# EasyEDA Pro project Battery_Charger_V0.05.epro

# Schematic Schematic2

## Sheets
1 P1: Board Name: Battery_Charger_V0.02; Create Date: 2025-06-03; Page Name: P1; Project Name: OptoGrid_V0.02; Schematic Name: Schematic2; Update Date: 2025-06-11; Company: 嘉立创EDA; Page Size: A4; Version: V1.0
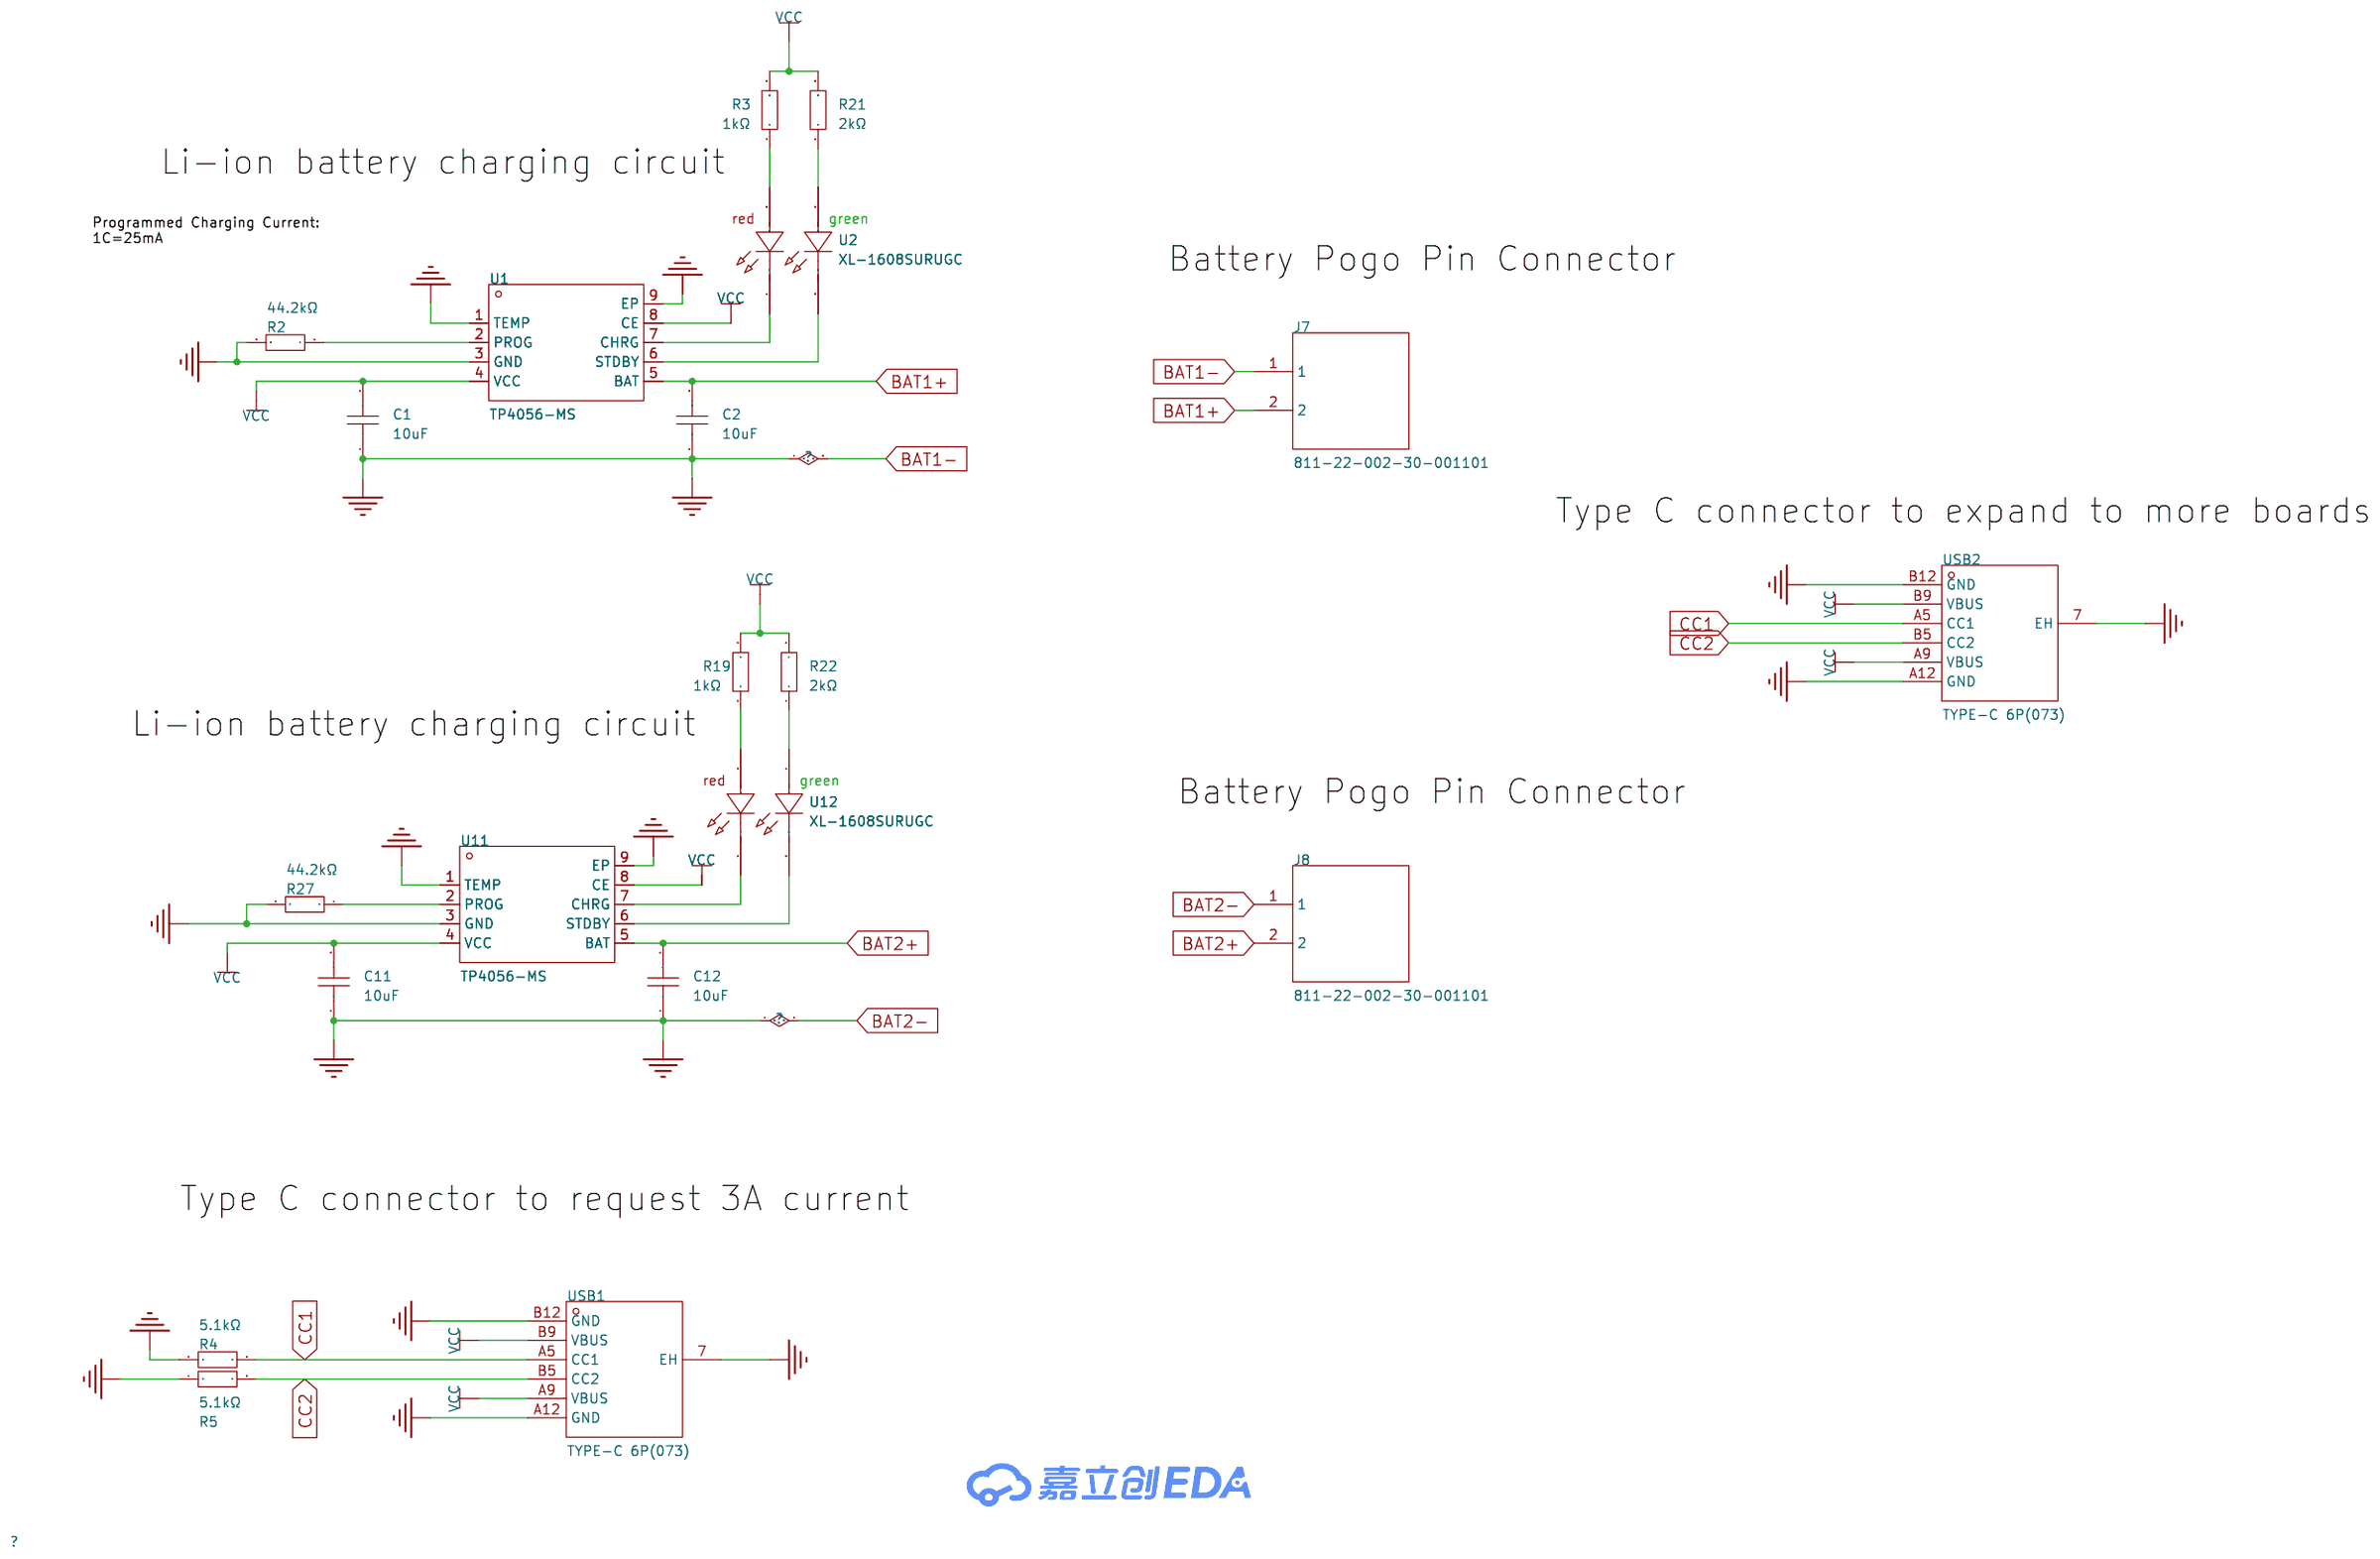
[diagram p0: P1]
2 P2: Create Date: 2025-06-04; Page Name: P2
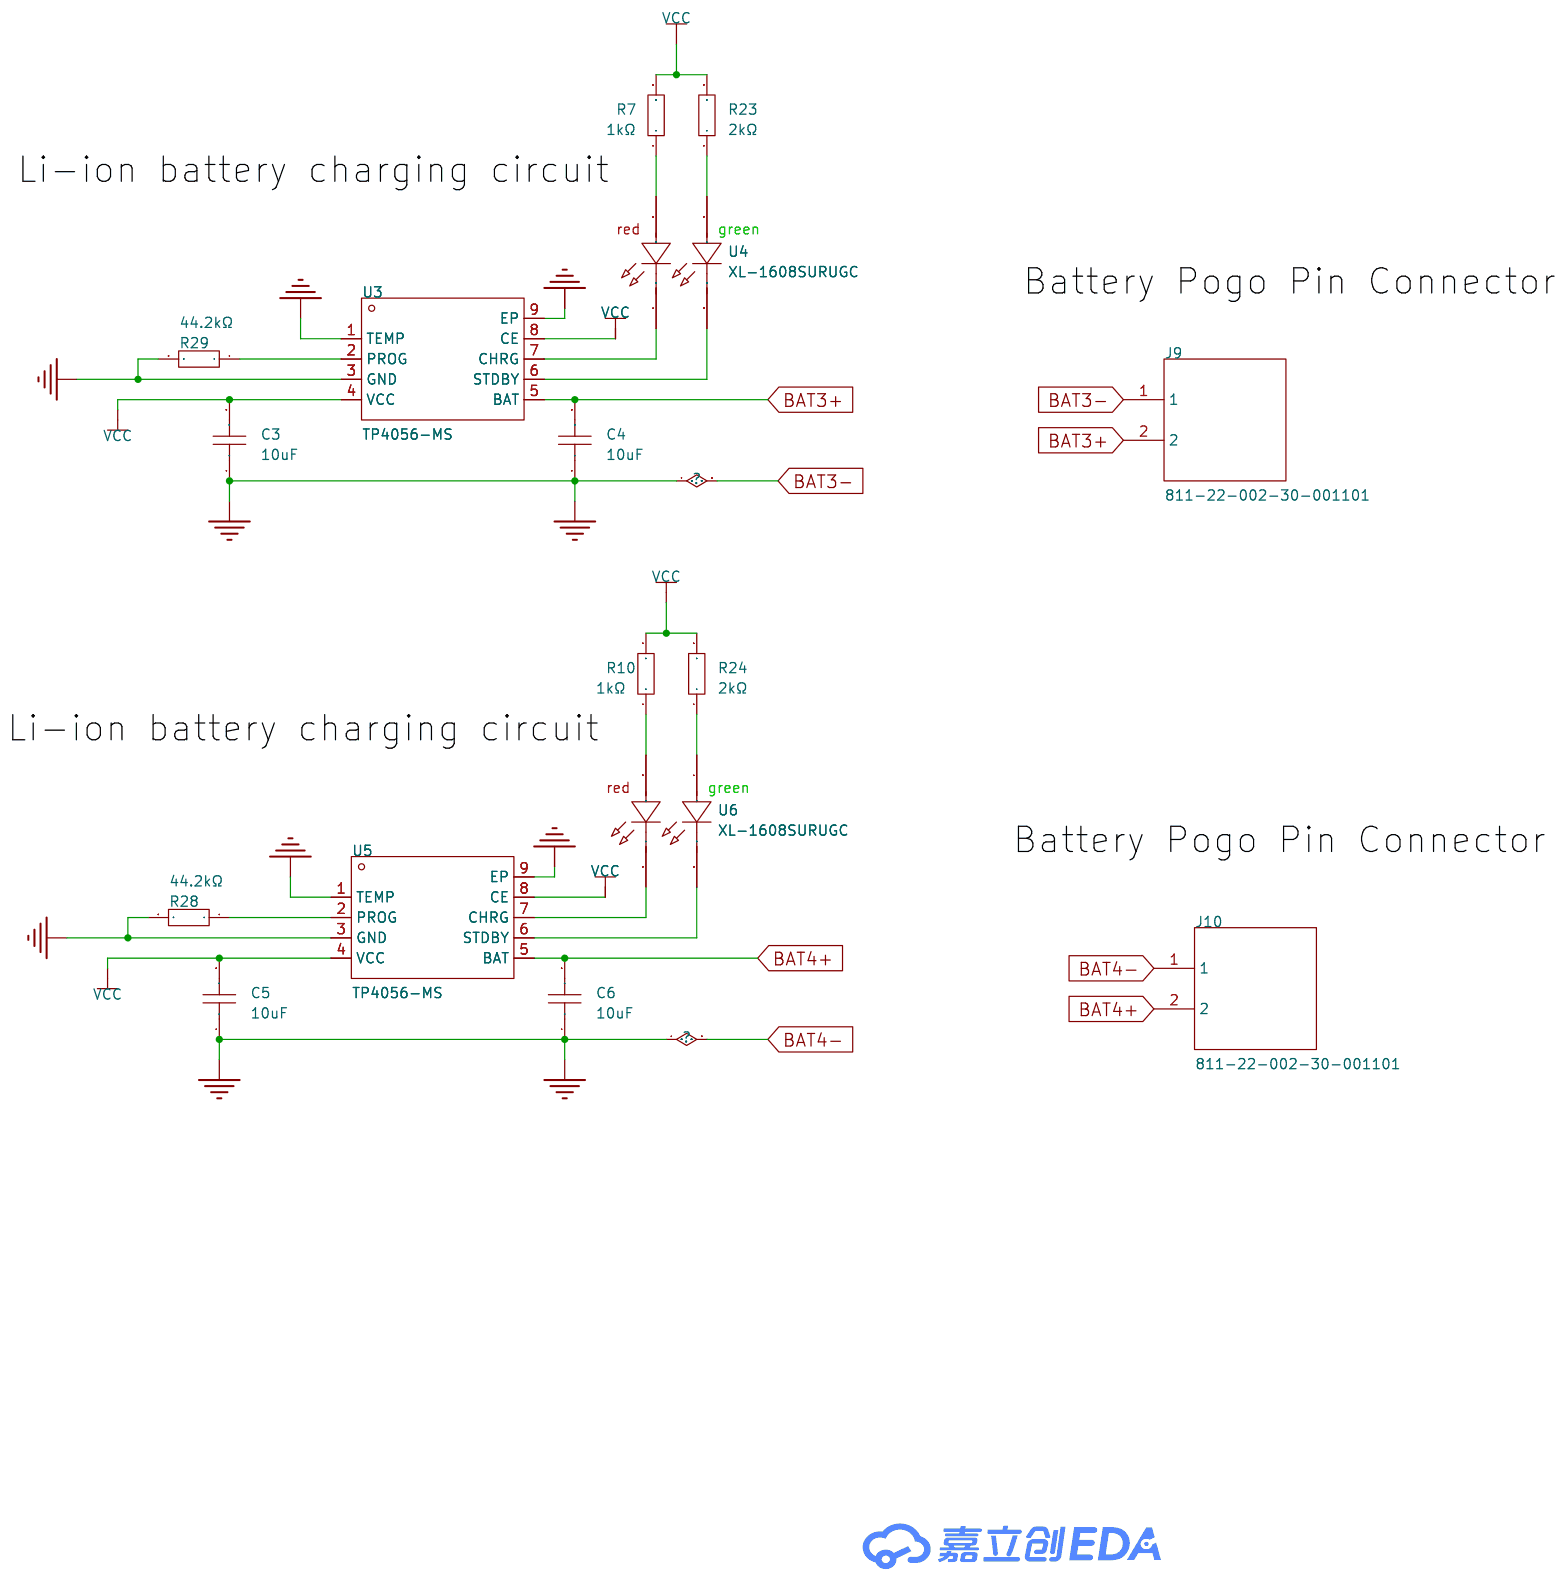
[diagram p1: P2]
3 P3: Create Date: 2025-06-04; Page Name: P3
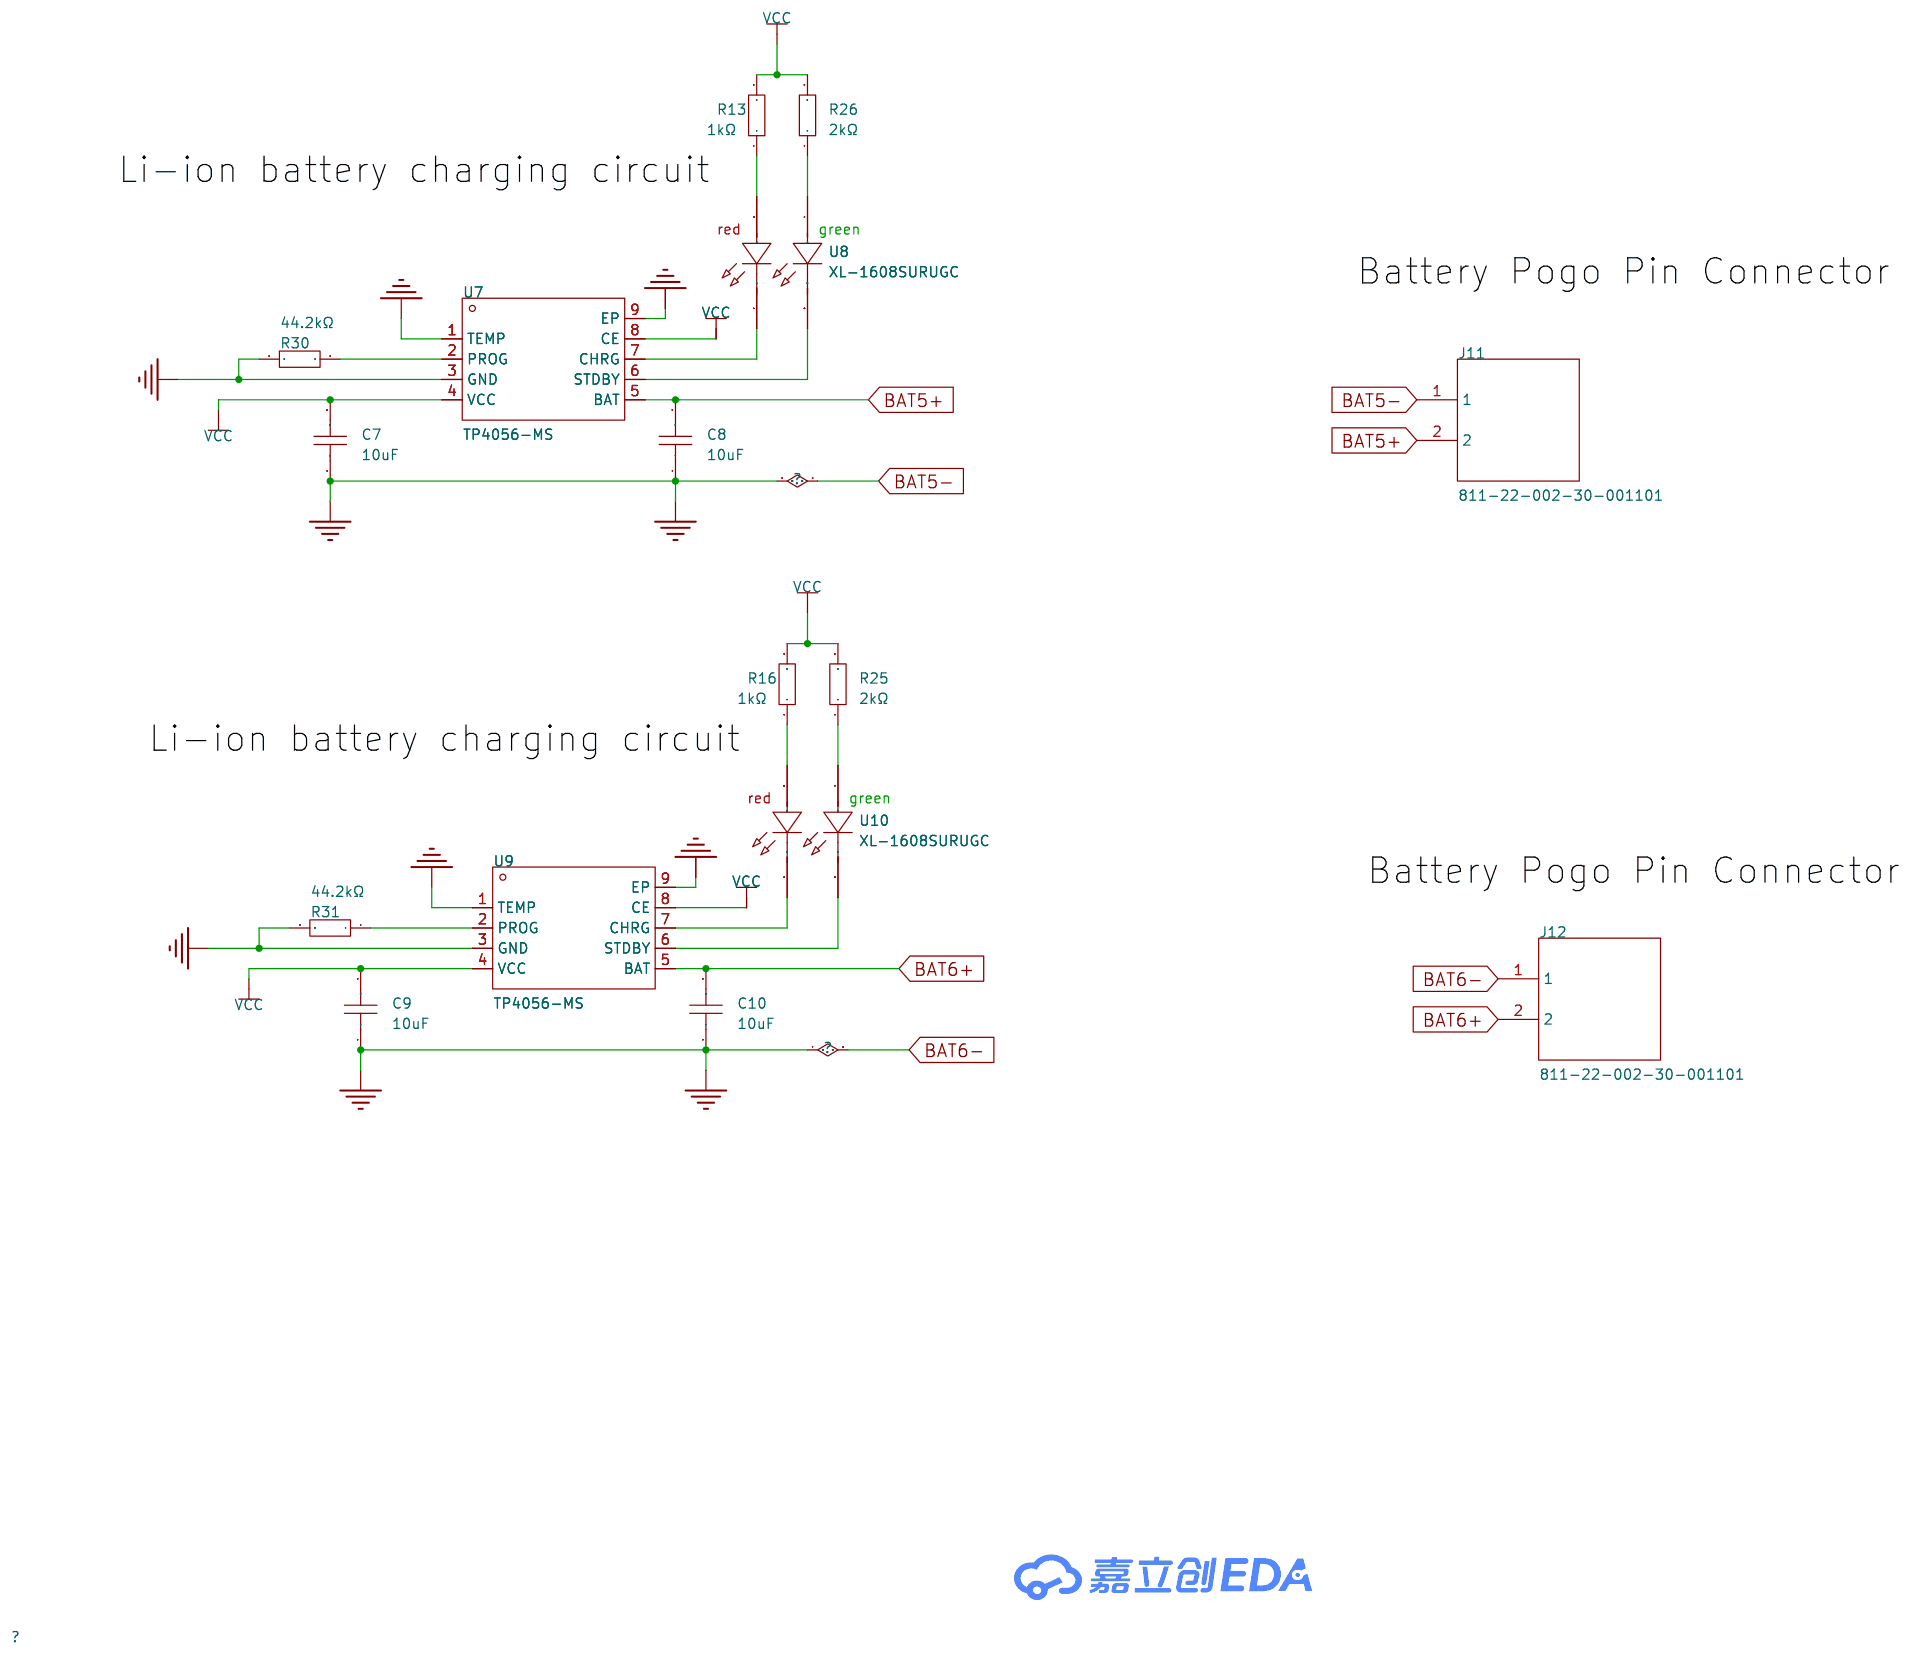
[diagram p2: P3]

## Parts
sheet P1
C1  10uF  [C0603]
C2  10uF  [C0603]
C11  10uF  [C0603]
C12  10uF  [C0603]
J7  811-22-002-30-001101  [MilMax_2Pin_2.54mmPitch_4.49mmTall_SMT]
J8  811-22-002-30-001101  [MilMax_2Pin_2.54mmPitch_4.49mmTall_SMT]
R2  44.2kΩ  [R0603]
R3  1kΩ  [R0603]
R4  5.1kΩ  [R0603]
R5  5.1kΩ  [R0603]
R19  1kΩ  [R0603]
R21  2kΩ  [R0603]
R22  2kΩ  [R0603]
R27  44.2kΩ  [R0603]
U1  TP4056-MS  [SOP-8_L4.9-W3.9-P1.27-LS6.0-TL-EP]
U2  XL-1608SURUGC  [LED-SMD_4P-L1.6-W0.8-RD_1]
U11  TP4056-MS  [SOP-8_L4.9-W3.9-P1.27-LS6.0-TL-EP]
U12  XL-1608SURUGC  [LED-SMD_4P-L1.6-W0.8-RD_1]
USB1  TYPE-C 6P(073)  [TYPE-C-SMD_TYPE-C-6P_5]
USB2  TYPE-C 6P(073)  [TYPE-C-SMD_TYPE-C-6P_5]
sheet P2
C3  10uF  [C0603]
C4  10uF  [C0603]
C5  10uF  [C0603]
C6  10uF  [C0603]
J9  811-22-002-30-001101  [MilMax_2Pin_2.54mmPitch_4.49mmTall_SMT]
J10  811-22-002-30-001101  [MilMax_2Pin_2.54mmPitch_4.49mmTall_SMT]
R7  1kΩ  [R0603]
R10  1kΩ  [R0603]
R23  2kΩ  [R0603]
R24  2kΩ  [R0603]
R28  44.2kΩ  [R0603]
R29  44.2kΩ  [R0603]
U3  TP4056-MS  [SOP-8_L4.9-W3.9-P1.27-LS6.0-TL-EP]
U4  XL-1608SURUGC  [LED-SMD_4P-L1.6-W0.8-RD_1]
U5  TP4056-MS  [SOP-8_L4.9-W3.9-P1.27-LS6.0-TL-EP]
U6  XL-1608SURUGC  [LED-SMD_4P-L1.6-W0.8-RD_1]
sheet P3
C7  10uF  [C0603]
C8  10uF  [C0603]
C9  10uF  [C0603]
C10  10uF  [C0603]
J11  811-22-002-30-001101  [MilMax_2Pin_2.54mmPitch_4.49mmTall_SMT]
J12  811-22-002-30-001101  [MilMax_2Pin_2.54mmPitch_4.49mmTall_SMT]
R13  1kΩ  [R0603]
R16  1kΩ  [R0603]
R25  2kΩ  [R0603]
R26  2kΩ  [R0603]
R30  44.2kΩ  [R0603]
R31  44.2kΩ  [R0603]
U7  TP4056-MS  [SOP-8_L4.9-W3.9-P1.27-LS6.0-TL-EP]
U8  XL-1608SURUGC  [LED-SMD_4P-L1.6-W0.8-RD_1]
U9  TP4056-MS  [SOP-8_L4.9-W3.9-P1.27-LS6.0-TL-EP]
U10  XL-1608SURUGC  [LED-SMD_4P-L1.6-W0.8-RD_1]

## Library data of the parts
C1-C12 = CL10A106MA8NRNC: 容值:10uF;精度:±20%;额定电压:25V;材质(温度系数):X5R;; LCSC Part Name: 10uF ±20% 25V; Supplier Part: C96446; Manufacturer: SAMSUNG(三星); Supplier Footprint: 0603; JLCPCB Part Class: 基础库; Datasheet: https://atta.szlcsc.com/upload/public/pdf/source/20160218/1457707763339.pdf; Supplier: LCSC; Tolerance: ±20%; Voltage Rated: 25V; Temperature Coefficient: X5R
J7-J12 = MilMax_2Pin_2.54mmPitch_4.49mmTall_SMT
R2 R27-R31 = 0603WAF4422T5E: 电阻类型:厚膜电阻;阻值:44.2kΩ;精度:±1%;功率:100mW;最大工作电压:75V;温度系数:±100ppm/℃;; LCSC Part Name: 44.2kΩ ±1% 100mW 厚膜电阻; Supplier Part: C23056; Manufacturer: UNI-ROYAL(厚声); Supplier Footprint: 0603; JLCPCB Part Class: 扩展库; Datasheet: https://atta.szlcsc.com/upload/public/pdf/source/20200306/C422600_1E6D84923E4A46A82E41ADD87F860B5C.pdf; Supplier: LCSC; Type: 厚膜电阻; Tolerance: ±1%; Power(Watts): 100mW; Overload Voltage (Max): 75V; Temperature Coefficient: ±100ppm/℃; Operating Temperature Range: -55℃~+155℃
R3 R7 R10 R13 R16 R19 = 0603WAF1001T5E: 电阻类型:厚膜电阻;阻值:1kΩ;精度:±1%;功率:100mW;最大工作电压:75V;温度系数:±100ppm/℃;; LCSC Part Name: 1kΩ ±1% 100mW 厚膜电阻; Supplier Part: C21190; Manufacturer: UNI-ROYAL(厚声); Supplier Footprint: 0603; JLCPCB Part Class: 基础库; Datasheet: https://atta.szlcsc.com/upload/public/pdf/source/20200306/C422600_1E6D84923E4A46A82E41ADD87F860B5C.pdf; Supplier: LCSC; Type: 厚膜电阻; Tolerance: ±1%; Power(Watts): 100mW; Overload Voltage (Max): 75V; Temperature Coefficient: ±100ppm/℃; Operating Temperature Range: -55℃~+155℃
R4 R5 = 0603WAF5101T5E: 电阻类型:厚膜电阻;阻值:5.1kΩ;精度:±1%;功率:100mW;最大工作电压:75V;温度系数:±100ppm/℃;; LCSC Part Name: 5.1kΩ ±1% 100mW 厚膜电阻; Supplier Part: C23186; Manufacturer: UNI-ROYAL(厚声); Supplier Footprint: 0603; JLCPCB Part Class: 基础库; Datasheet: https://atta.szlcsc.com/upload/public/pdf/source/20200306/C422600_1E6D84923E4A46A82E41ADD87F860B5C.pdf; Supplier: LCSC; Type: 厚膜电阻; Tolerance: ±1%; Power(Watts): 100mW; Overload Voltage (Max): 75V; Temperature Coefficient: ±100ppm/℃; Operating Temperature Range: -55℃~+155℃
R21-R26 = 0603WAF2001T5E: 电阻类型:厚膜电阻;阻值:2kΩ;精度:±1%;功率:100mW;最大工作电压:75V;温度系数:±100ppm/℃;; LCSC Part Name: 2kΩ ±1% 100mW 厚膜电阻; Supplier Part: C22975; Manufacturer: UNI-ROYAL(厚声); Supplier Footprint: 0603; JLCPCB Part Class: 基础库; Datasheet: https://atta.szlcsc.com/upload/public/pdf/source/20200306/C422600_1E6D84923E4A46A82E41ADD87F860B5C.pdf; Supplier: LCSC; Type: 厚膜电阻; Tolerance: ±1%; Power(Watts): 100mW; Overload Voltage (Max): 75V; Temperature Coefficient: ±100ppm/℃; Operating Temperature Range: -55℃~+155℃
U1 U3 U5 U7 U9 U11 = TP4056-MS: 电源电压:4.2V~9V;最大充电电流:1A;电池类型:锂离子/聚合物;电池节数:1;; Supplier Part: C7473158; Manufacturer: MSKSEMI(美森科); Supplier Footprint: SOP-8-EP; JLCPCB Part Class: 扩展库; Datasheet: https://atta.szlcsc.com/upload/public/pdf/source/20230808/7F9175670C53D6763A7A5691214AEA38.pdf; Supplier: LCSC; Supply Voltage: 4.2V~9V; Maximum Charge Current: 1A; Type of Battery: 锂离子/聚合物; Number of Cells: 1; Operating Temperature: -40℃~+85℃
U2 U4 U6 U8 U10 U12 = XL-1608SURUGC: 发光颜色:红色,翠绿色;正向电压(VF):1.8V~2.6V；2.8V~3.5V;功率:55mW；80mW;正向电流:5mA;主波长:520nm~530nm；620nm~630nm;透镜颜色:无色透明透镜;发光强度:150mcd；550mcd;发光角度:120°;载带方式:正贴;工作温度:-30℃~+85℃;; Supplier Part: C5349934; Manufacturer: XINGLIGHT(成兴光); Supplier Footprint: 0603; JLCPCB Part Class: 扩展库; Datasheet: https://atta.szlcsc.com/upload/public/pdf/source/20240218/94D5F658D77F47F55D1FA89E14F144F1.pdf; Supplier: LCSC; Emitted Color: 红色,翠绿色; Forward Voltage (VF): 1.8V~2.6V；2.8V~3.5V; Power Dissipation: 55mW；80mW; Forward Current: 5mA; Dominant Wavelength: 520nm~530nm；620nm~630nm; Lens Color: 无色透明透镜; Luminous Intensity: 150mcd；550mcd; Viewing Angle: 120°; Mounting Sytle: 正贴; Operating Temperature: -30℃~+85℃
USB1 USB2 = TYPE-C 6P(073): 连接器类型:Type-C;标准:USB 3.1;公母:母;安装方式:卧贴;触点数量:6P;端口数量:1;额定电流 - 电源:3A;工作温度范围:-25℃~+85℃;; LCSC Part Name: Type-C 母 卧贴; Supplier Part: C668623; Manufacturer: SHOU HAN(首韩); Supplier Footprint: SMD; JLCPCB Part Class: Extended Part; Datasheet: https://atta.szlcsc.com/upload/public/pdf/source/20200618/C668623_A4B260DED7AC1949BAC6AE39E9F4CD80.pdf; Supplier: LCSC; Connector Type: Type-C; Standard: USB 3.1; Gender: 母; Mounting Style: 卧贴; Number of Contacts: 6P; Number of Ports: 1; Current Rating - Power (Max): 3A; Operating Temperature Range: -25℃~+85℃; Rated Voltage (Max): 5V; Connect-Disconnect Life: 1万次; Core Colour: 黑色

## Nets
GND: C1.1 C2.1 C3.1 C4.1 C5.1 C6.1 C7.1 C8.1 C9.1 C10.1 C11.1 C12.1 J7.1 J8.1 J9.1 J10.1 J11.1 J12.1 R2.2 R4.1 R5.1 R27.2 R28.2 R29.2 R30.2 R31.2 U1.1(TEMP) U1.3(GND) U1.9(EP) U3.1(TEMP) U3.3(GND) U3.9(EP) U5.1(TEMP) U5.3(GND) U5.9(EP) U7.1(TEMP) U7.3(GND) U7.9(EP) U9.1(TEMP) U9.3(GND) U9.9(EP) U11.1(TEMP) U11.3(GND) U11.9(EP) USB1.7(EH) USB1.A12(GND) USB1.B12(GND) USB2.7(EH) USB2.A12(GND) USB2.B12(GND)
VCC: C1.2 C3.2 C5.2 C7.2 C9.2 C11.2 R3.2 R7.2 R10.2 R13.2 R16.2 R19.2 R21.2 R22.2 R23.2 R24.2 R25.2 R26.2 U1.4(VCC) U1.8(CE) U3.4(VCC) U3.8(CE) U5.4(VCC) U5.8(CE) U7.4(VCC) U7.8(CE) U9.4(VCC) U9.8(CE) U11.4(VCC) U11.8(CE) USB1.A9(VBUS) USB1.B9(VBUS) USB2.A9(VBUS) USB2.B9(VBUS)
BAT1+: C2.2 J7.2 U1.5(BAT)
BAT2+: C12.2 J8.2 U11.5(BAT)
BAT3+: C4.2 J9.2 U3.5(BAT)
BAT4+: C6.2 J10.2 U5.5(BAT)
BAT5+: C8.2 J11.2 U7.5(BAT)
BAT6+: C10.2 J12.2 U9.5(BAT)
CC1: R4.2 USB1.A5(CC1) USB2.A5(CC1)
CC2: R5.2 USB1.B5(CC2) USB2.B5(CC2)
$1N548: R2.1 U1.2(PROG)
$1N639: U1.7(CHRG) U2.1
$1N644: U1.6(STDBY) U2.3
$1N1007: R3.1 U2.2
$1N1011: R21.1 U2.4
$1N2602: R27.1 U11.2(PROG)
$1N2606: U11.7(CHRG) U12.1
$1N2607: U11.6(STDBY) U12.3
$1N2612: R19.1 U12.2
$1N2614: R22.1 U12.4
$2N542: R29.1 U3.2(PROG)
$2N546: U3.7(CHRG) U4.1
$2N547: U3.6(STDBY) U4.3
$2N552: R7.1 U4.2
$2N554: R23.1 U4.4
$2N1052: R28.1 U5.2(PROG)
$2N1056: U5.7(CHRG) U6.1
$2N1057: U5.6(STDBY) U6.3
$2N1062: R10.1 U6.2
$2N1064: R24.1 U6.4
$3N489: R26.1 U8.4
$3N491: R13.1 U8.2
$3N496: U7.7(CHRG) U8.1
$3N497: U7.6(STDBY) U8.3
$3N514: R30.1 U7.2(PROG)
$3N950: R25.1 U10.4
$3N952: R16.1 U10.2
$3N957: U9.7(CHRG) U10.1
$3N958: U9.6(STDBY) U10.3
$3N975: R31.1 U9.2(PROG)

## Notes on the sheets
sheet 1
- Li-ion battery charging circuit
- red
- green
- Programmed Charging Current:
  1C=25mA
- Battery Pogo Pin Connector
- Type C connector to expand to more boards
- Li-ion battery charging circuit
- red
- green
- Battery Pogo Pin Connector
- Type C connector to request 3A current
sheet 2
- Li-ion battery charging circuit
- red
- green
- Battery Pogo Pin Connector
- Li-ion battery charging circuit
- red
- green
- Battery Pogo Pin Connector
sheet 3
- Li-ion battery charging circuit
- red
- green
- Battery Pogo Pin Connector
- Li-ion battery charging circuit
- red
- green
- Battery Pogo Pin Connector

# Board Battery_Charger_V0.05
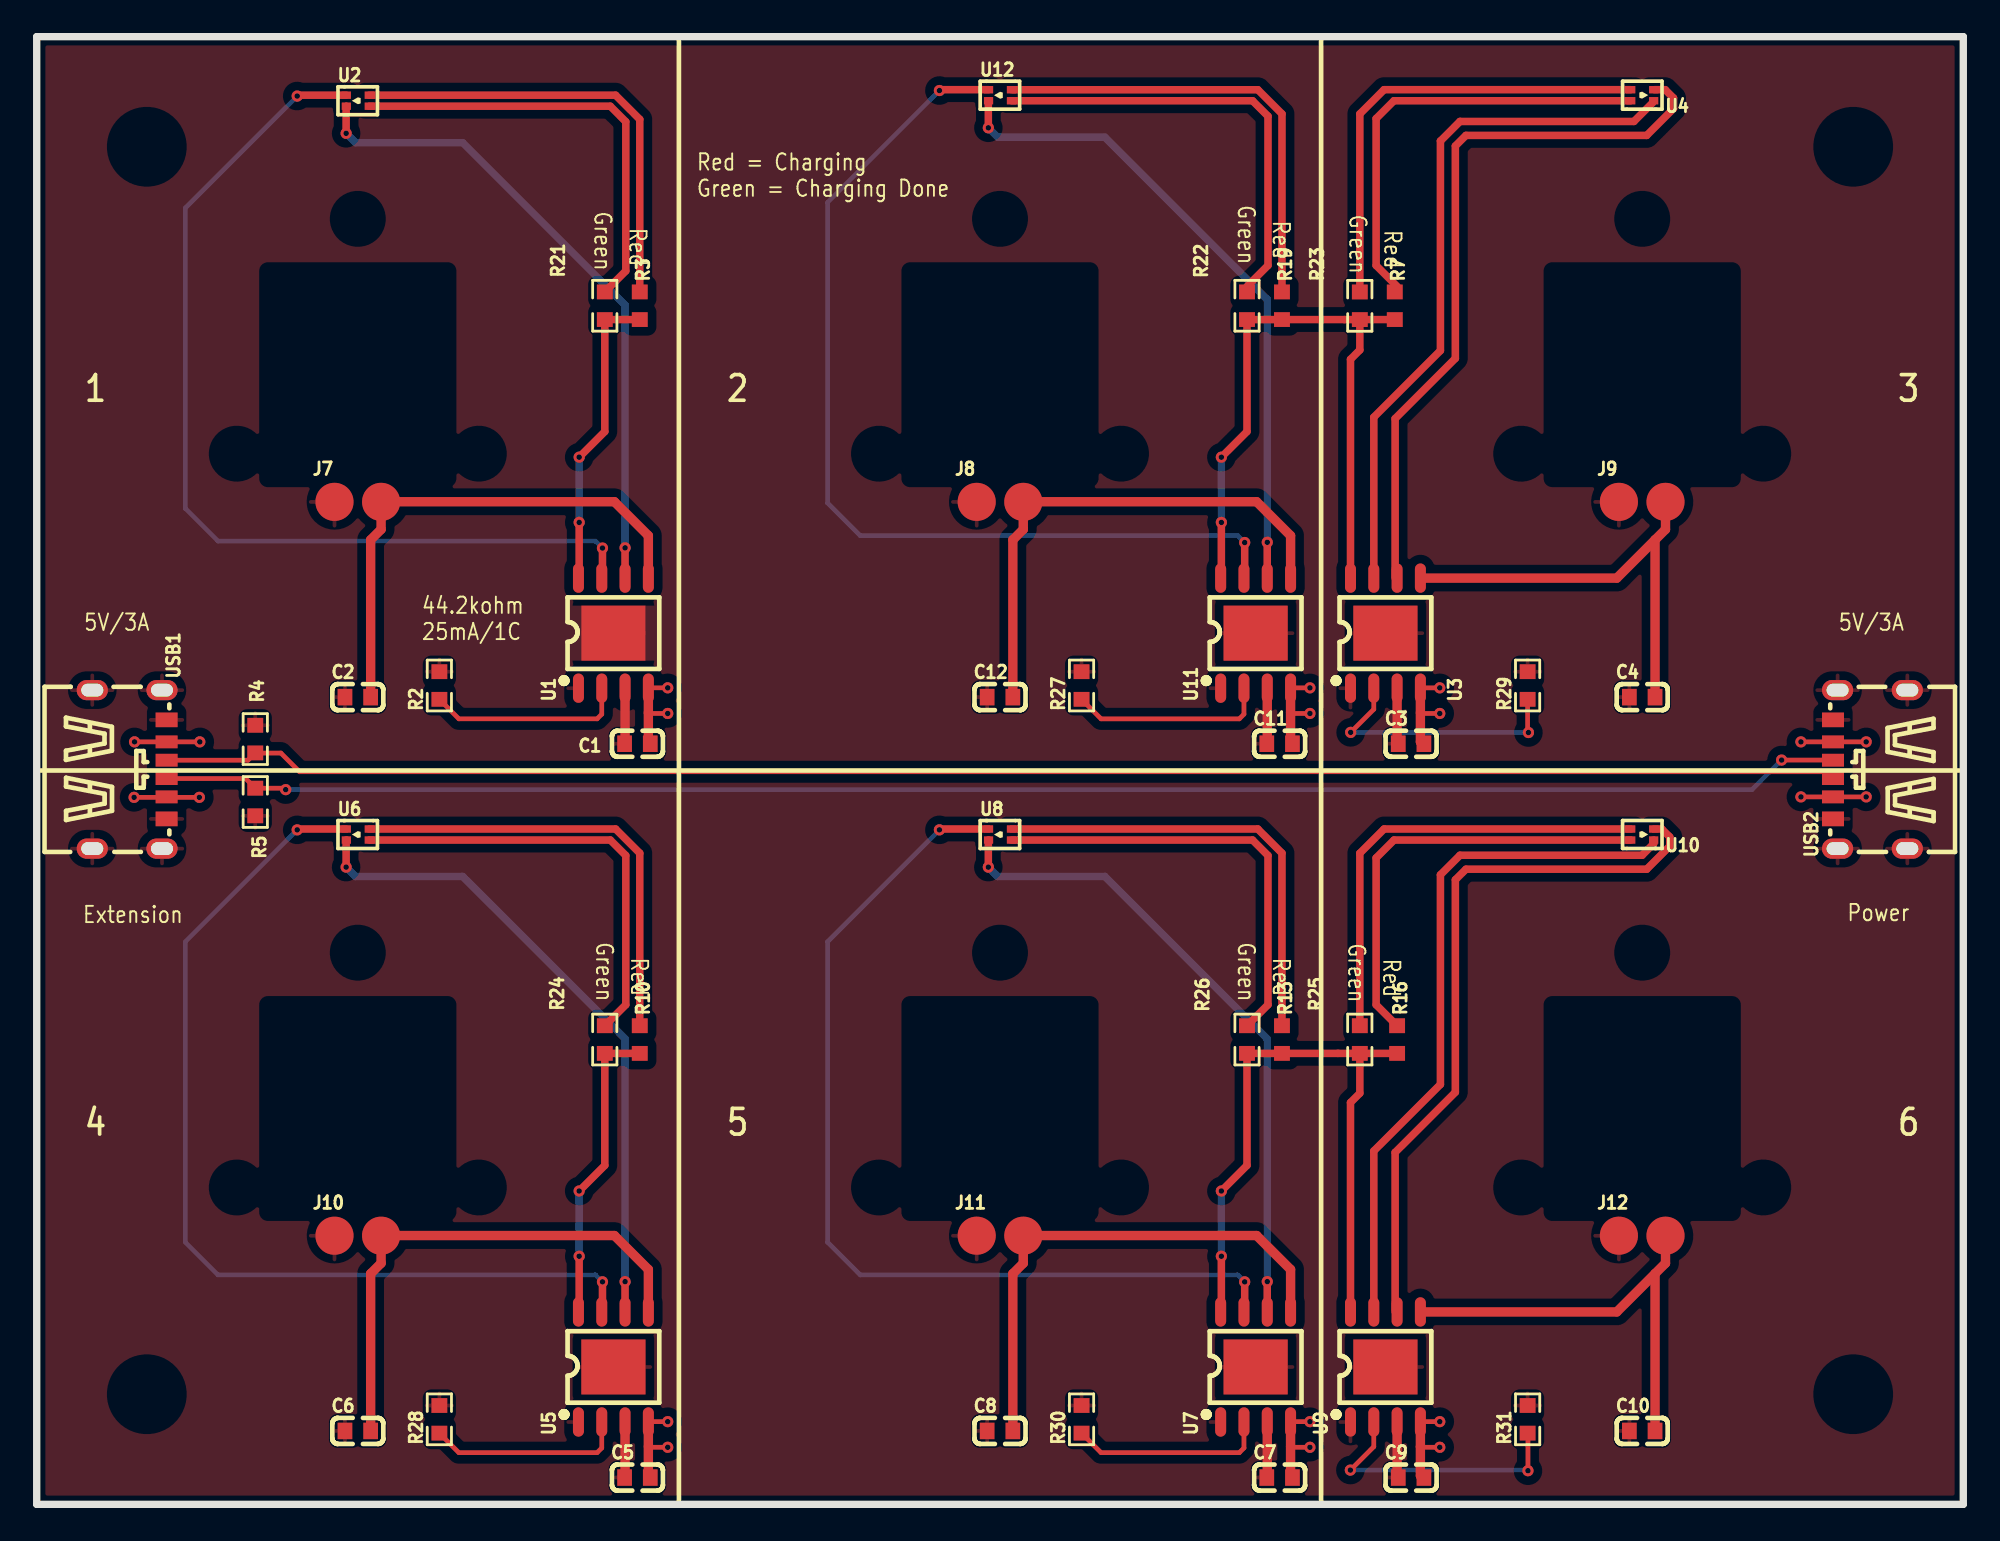
[diagram p3: board, top side]
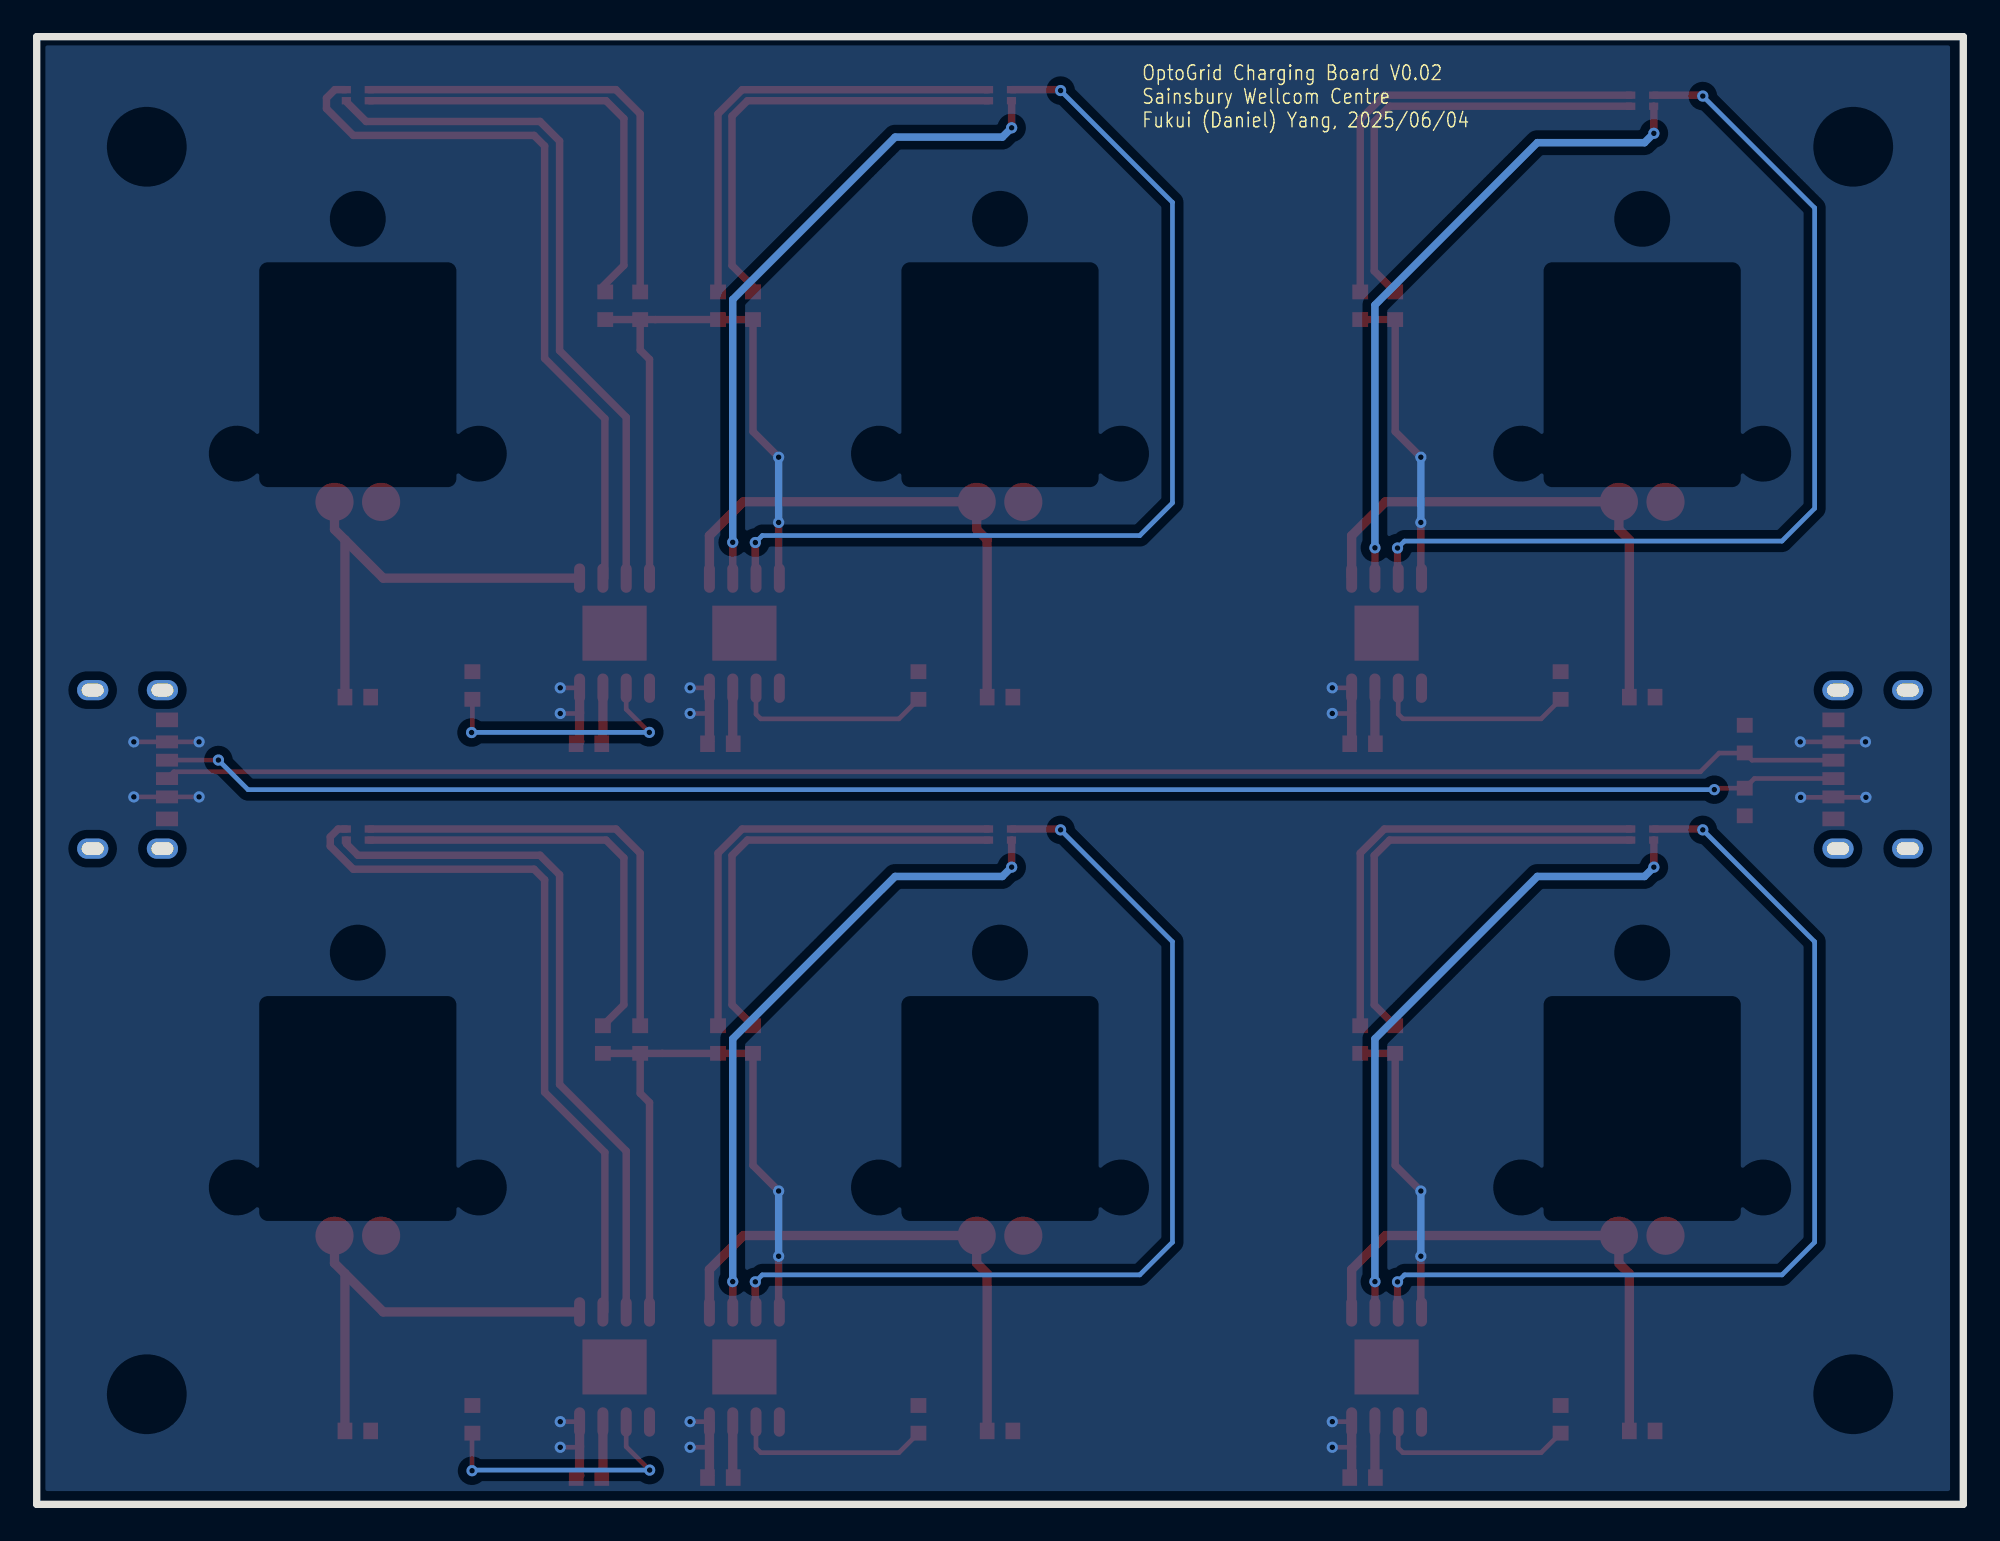
[diagram p4: board, bottom side, seen from below]

Outline 105 x 80 mm; copper layers: Top Layer, Bottom Layer. Coordinates in mm from the lower left corner of the outline.
Outline path: 0,80 0,0 105,0 105,80 0,80
Stack: Top Layer 0.035mm / Dielectric1 1.51mm FR4 er 4.5 / Bottom Layer 0.035mm

## Design rules (mm)
template: 自定义配置
spacing copperThickness1oz (default): track to track 0.102, other pairs 0.152 to 0.3
spacing copperThickness2oz: track to track 0.203, other pairs 0.152 to 0.3
track width copperThickness1oz (default): min 0.127, default 0.254, max 2.54
track width copperThickness2oz: min 0.203, default 0.254, max 2.54
differential pair differentialPair (default): width min 0.127, default 0.254, max 2.54; gap min 0.152, default 0.152
via viaSize (default): diameter min 0.5, default 0.61, max 10; hole min 0.3, default 0.305, max 6.3

## Placement (name value [footprint] x y rotation side)
C1  10uF  [C0603]  32.74 41.46 0 top
C2  10uF  [C0603]  17.5 44 0 top
C3  10uF  [C0603]  74.9 41.46 0 top
C4  10uF  [C0603]  87.5 44 0 top
C5  10uF  [C0603]  32.74 1.46 0 top
C6  10uF  [C0603]  17.5 4 0 top
C7  10uF  [C0603]  67.74 1.46 0 top
C8  10uF  [C0603]  52.5 4 0 top
C9  10uF  [C0603]  74.9 1.46 0 top
C10  10uF  [C0603]  87.5 4 0 top
C11  10uF  [C0603]  67.74 41.46 0 top
C12  10uF  [C0603]  52.5 44 0 top
J7  811-22-002-30-001101  [MilMax_2Pin_2.54mmPitch_4.49mmTall_SMT]  17.5 54.64 0 top
J8  811-22-002-30-001101  [MilMax_2Pin_2.54mmPitch_4.49mmTall_SMT]  52.5 54.64 0 top
J9  811-22-002-30-001101  [MilMax_2Pin_2.54mmPitch_4.49mmTall_SMT]  87.5 54.64 0 top
J10  811-22-002-30-001101  [MilMax_2Pin_2.54mmPitch_4.49mmTall_SMT]  17.5 14.64 0 top
J11  811-22-002-30-001101  [MilMax_2Pin_2.54mmPitch_4.49mmTall_SMT]  52.5 14.64 0 top
J12  811-22-002-30-001101  [MilMax_2Pin_2.54mmPitch_4.49mmTall_SMT]  87.5 14.64 0 top
R2  44.2kΩ  [R0603]  21.94 44.63 90 top
R3  1kΩ  [R0603]  32.87 65.33 270 top
R4  5.1kΩ  [R0603]  11.91 41.71 270 top
R5  5.1kΩ  [R0603]  11.91 38.28 90 top
R7  1kΩ  [R0603]  74.01 65.33 270 top
R10  1kΩ  [R0603]  32.87 25.33 270 top
R13  1kΩ  [R0603]  67.87 25.33 270 top
R16  1kΩ  [R0603]  74.14 25.33 270 top
R19  1kΩ  [R0603]  67.87 65.33 270 top
R21  2kΩ  [R0603]  30.96 65.33 270 top
R22  2kΩ  [R0603]  65.96 65.33 270 top
R23  2kΩ  [R0603]  72.11 65.33 270 top
R24  2kΩ  [R0603]  30.96 25.33 270 top
R25  2kΩ  [R0603]  72.11 25.33 270 top
R26  2kΩ  [R0603]  65.96 25.33 270 top
R27  44.2kΩ  [R0603]  56.94 44.63 90 top
R28  44.2kΩ  [R0603]  21.94 4.63 90 top
R29  44.2kΩ  [R0603]  81.26 44.63 90 top
R30  44.2kΩ  [R0603]  56.94 4.63 90 top
R31  44.2kΩ  [R0603]  81.26 4.63 90 top
U1  TP4056-MS  [SOP-8_L4.9-W3.9-P1.27-LS6.0-TL-EP]  31.43 47.49 90 top
U2  XL-1608SURUGC  [LED-SMD_4P-L1.6-W0.8-RD_1]  17.5 76.51 0 top
U3  TP4056-MS  [SOP-8_L4.9-W3.9-P1.27-LS6.0-TL-EP]  73.51 47.49 90 top
U4  XL-1608SURUGC  [LED-SMD_4P-L1.6-W0.8-RD_1]  87.5 76.81 180 top
U5  TP4056-MS  [SOP-8_L4.9-W3.9-P1.27-LS6.0-TL-EP]  31.43 7.49 90 top
U6  XL-1608SURUGC  [LED-SMD_4P-L1.6-W0.8-RD_1]  17.5 36.51 0 top
U7  TP4056-MS  [SOP-8_L4.9-W3.9-P1.27-LS6.0-TL-EP]  66.43 7.49 90 top
U8  XL-1608SURUGC  [LED-SMD_4P-L1.6-W0.8-RD_1]  52.5 36.51 0 top
U9  TP4056-MS  [SOP-8_L4.9-W3.9-P1.27-LS6.0-TL-EP]  73.51 7.49 90 top
U10  XL-1608SURUGC  [LED-SMD_4P-L1.6-W0.8-RD_1]  87.5 36.51 180 top
U11  TP4056-MS  [SOP-8_L4.9-W3.9-P1.27-LS6.0-TL-EP]  66.43 47.49 90 top
U12  XL-1608SURUGC  [LED-SMD_4P-L1.6-W0.8-RD_1]  52.5 76.81 0 top
USB1  TYPE-C 6P(073)  [TYPE-C-SMD_TYPE-C-6P_5]  5.05 40.06 270 top
USB2  TYPE-C 6P(073)  [TYPE-C-SMD_TYPE-C-6P_5]  99.92 40.06 90 top

## Footprints (pads in the part's own frame, mm; a bottom-side part is the same pattern mirrored in y, then rotated)
C0603
  rect 0.8x0.9 smd: 1(-0.7,0) 2(0.7,0)
LED-SMD_4P-L1.6-W0.8-RD_1
  rect 0.5x0.4 smd: 1(-0.625,0.3) 2(0.625,0.3) 3(-0.625,-0.3) 4(0.625,-0.3)
MilMax_2Pin_2.54mmPitch_4.49mmTall_SMT
  round 2.08 smd: 1(-1.27,0) 2(1.27,0)
R0603
  rect 0.806x0.864 smd: 1(-0.753,0) 2(0.753,0)
SOP-8_L4.9-W3.9-P1.27-LS6.0-TL-EP
  oval 1.6x0.6 smd: 1(-3,1.905) 2(-3,0.635) 3(-3,-0.635) 4(-3,-1.905) 5(3,-1.905) 6(3,-0.635) 7(3,0.635) 8(3,1.905)
  rect 3x3.5 smd: 9(0,0)
TYPE-C-SMD_TYPE-C-6P_5
  oval 1.1x1.7 hole 0.7x1.2: 7(-4.32,1.775) 7(-4.32,-2.025) 7(4.32,1.775) 7(4.32,-2.025)
  rect 0.7x1.2 smd: A5(-0.5,2.025) A9(1.5,2.025) B5(0.5,2.025) B9(-1.5,2.025)
  rect 0.8x1.2 smd: A12(2.7,2.025) B12(-2.7,2.025)

## Nets
As in the schematic.

## Via types
v1: diameter 0.61, hole 0.305, Top Layer to Bottom Layer, 50 vias

## Routing (per net, layer and track width the routed paths; a pad name or vN(x,y) marks a point on that pad's centre or on a via; arc(x,y) is an arc through that point)
GND: length 18.2
  Top Layer w0.508: U11.3 67.07,41.48 C11.1 ; U9.3 74.14,1.48 74.12,1.46 ; C7.1 67.07,1.48 U7.3 ; U3.3 74.14,41.48 74.12,41.46 ; U1.3 32.07,41.48 C1.1 ; C5.1 32.07,1.48 U5.3
VCC: length 152.9
  Top Layer w0.254: v1(69.39,44.51) 68.35,44.51 U11.4 ; 7.06,38.54 USB1.A9 ; 7.06,38.54 v1(5.31,38.54) ; 7.06,38.54 v1(8.86,38.54) ; 68.34,3.15 68.37,3.11 v1(69.39,3.11) ; v1(76.47,44.51) 75.43,44.51 U3.4 ; v1(34.39,3.11) 33.37,3.11 33.34,3.15 ; v1(34.39,43.11) 33.37,43.11 33.34,43.15 ; U5.4 33.35,4.51 v1(34.39,4.51) ; U1.4 33.36,44.51 v1(34.39,44.51) ; 75.41,43.15 75.45,43.11 v1(76.47,43.11) ; U9.4 75.43,4.51 v1(76.47,4.51) ; v1(76.47,3.11) 75.45,3.11 75.41,3.15 ; v1(5.33,41.56) USB1.B9 v1(8.89,41.56) ; U7.4 68.35,4.51 v1(69.39,4.51) ; v1(96.15,38.56) USB2.B9 v1(99.71,38.56) ; 68.34,43.15 68.37,43.11 v1(69.39,43.11) ; v1(96.15,41.56) USB2.A9 v1(99.71,41.56)
  Top Layer w0.406: 72.11,64.58 72.11,62.92 71.6,62.41 U3.8 ; 72.11,64.58 R7.2 ; 72.11,64.58 R19.2 ; R25.2 72.11,22.41 71.6,21.9 U9.8 ; R25.2 R16.2 ; R25.2 R13.2 ; v1(64.56,17.08) 65.96,18.48 R26.2 67.87,24.58 ; U1.8 29.56,50.53 v1(29.56,53.52) ; 67.87,64.58 R22.2 65.96,58.48 v1(64.56,57.08) ; v1(64.56,13.52) 64.56,10.53 U7.8 ; v1(64.56,53.52) 64.56,50.53 U11.8 ; v1(29.56,13.52) 29.56,10.53 U5.8 ; R3.2 R21.2 30.96,58.48 v1(29.56,57.08) ; 32.87,24.58 R24.2 30.96,18.48 v1(29.56,17.08)
  Top Layer w0.508: U3.4 75.41,41.56 75.52,41.46 ; U11.4 68.34,41.56 C11.2 ; U1.4 33.34,41.56 C1.2 ; C5.2 33.34,1.56 U5.4 ; C7.2 68.34,1.56 U7.4 ; U9.4 75.41,1.56 75.52,1.46
  Bottom Layer w0.406: v1(29.56,57.08) v1(29.56,53.52) ; v1(29.56,17.08) v1(29.56,13.52) ; v1(64.56,57.08) v1(64.56,53.52) ; v1(64.56,17.08) v1(64.56,13.52)
BAT1+: length 28.5
  Top Layer w0.508: U1.5 33.34,52.8 31.49,54.65 18.77,54.65 18.77,53.14 18.2,52.57 18.2,44
BAT2+: length 28.5
  Top Layer w0.508: 53.2,44 53.2,52.57 53.77,53.14 53.77,54.65 66.49,54.65 68.34,52.8 U11.5
BAT3+: length 24.5
  Top Layer w0.508: 88.77,54.65 88.77,53.14 88.2,52.57 ; 88.2,52.57 88.2,44 ; 88.2,52.57 86.12,50.49 U3.5
BAT4+: length 28.5
  Top Layer w0.508: 18.2,4 18.2,12.57 18.77,13.14 18.77,14.65 31.49,14.65 33.34,12.8 U5.5
BAT5+: length 28.5
  Top Layer w0.508: 53.2,4 53.2,12.57 53.77,13.14 53.77,14.65 66.49,14.65 68.34,12.8 U7.5
BAT6+: length 24.5
  Top Layer w0.508: 88.2,12.57 88.77,13.14 88.77,14.65 ; 88.2,12.57 86.12,10.49 U9.5 ; 88.2,12.57 88.2,4
CC1: length 91.6
  Top Layer w0.254: USB2.A5 97.53,39.93 14.33,39.93 13.31,40.95 11.92,40.95 R4.2 11.51,40.56 USB1.A5
CC2: length 91.7
  Top Layer w0.254: USB2.B5 97.89,40.57 v1(95.1,40.57) ; v1(13.57,38.96) 13.49,39.04 R5.2 11.39,39.56 USB1.B5
  Bottom Layer w0.254: v1(95.1,40.57) 93.48,38.96 v1(13.57,38.96)
$1N548: length 10.8
  Top Layer w0.254: U1.2 30.8,43.07 30.54,42.82 23.01,42.82 R2.1
$1N639: length 53
  Top Layer w0.406: v1(14.2,76.76) 14.24,76.81 U2.1 ; U1.7 30.83,50.53 v1(30.83,52.13)
  Bottom Layer w0.254: v1(30.83,52.13) 30.45,52.51 9.88,52.51 8.1,54.28 8.1,70.67 v1(14.2,76.76)
$1N644: length 35.4
  Top Layer w0.406: v1(16.86,74.73) 16.86,76.2 U2.3 ; v1(32.07,52.14) U1.6
  Bottom Layer w0.406: v1(16.86,74.73) 17.37,74.22 23.22,74.22 32.07,65.37 v1(32.07,52.14)
$1N1007: length 24.7
  Top Layer w0.406: R3.1 32.87,75.49 31.55,76.81 U2.2
$1N1011: length 24.1
  Top Layer w0.406: U2.4 31.26,76.21 32.11,75.37 32.11,67.23 R21.1
$1N2602: length 10.8
  Top Layer w0.254: R27.1 58.01,42.82 65.54,42.82 65.8,43.07 U11.2
$1N2606: length 53
  Top Layer w0.406: 65.8,50.79 65.84,50.83 v1(65.84,52.43) ; v1(49.2,77.06) 49.24,77.11 U12.1
  Bottom Layer w0.254: v1(49.2,77.06) 43.1,70.97 43.1,54.59 44.88,52.81 65.45,52.81 v1(65.84,52.43)
$1N2607: length 35.4
  Top Layer w0.406: v1(51.87,75.03) 51.87,76.5 U12.3 ; v1(67.07,52.44) 67.07,50.79
  Bottom Layer w0.406: v1(67.07,52.44) 67.07,65.67 58.22,74.53 52.37,74.53 v1(51.87,75.03)
$1N2612: length 24.7
  Top Layer w0.406: 53.13,77.11 66.55,77.11 67.87,75.79 67.87,66.39
$1N2614: length 24.1
  Top Layer w0.406: 53.13,76.51 66.26,76.51 67.11,75.67 67.11,67.53 65.96,66.39
$2N542: length 14.4
  Top Layer w0.254: v1(71.61,42.08) 72.87,43.34 U3.2 ; R29.1 81.26,42.11 v1(81.3,42.07)
  Bottom Layer w0.254: v1(71.61,42.08) 81.29,42.08 v1(81.3,42.07)
$2N546: length 37.7
  Top Layer w0.406: 88.08,76.41 87.05,75.38 77.57,75.38 76.5,74.31 76.5,62.89 72.87,59.26 72.87,50.54 72.89,50.52
$2N547: length 39.4
  Top Layer w0.406: 74.03,50.5 74.03,59.18 77.32,62.46 77.32,74.04 77.89,74.62 87.75,74.62 89.21,76.08 89.21,76.66 88.75,77.11 88.17,77.11
$2N552: length 23.9
  Top Layer w0.406: U4.2 73.97,76.51 73,75.54 73,67.53 74.14,66.39
$2N554: length 24.7
  Top Layer w0.406: U4.4 73.43,77.11 72.11,75.79 72.11,66.39
$2N1052: length 10.8
  Top Layer w0.254: U5.2 30.8,3.07 30.54,2.82 23.01,2.82 R28.1
$2N1056: length 53
  Top Layer w0.406: v1(14.2,36.76) 14.24,36.81 U6.1 ; U5.7 30.83,10.53 v1(30.83,12.13)
  Bottom Layer w0.254: v1(30.83,12.13) 30.45,12.51 9.88,12.51 8.1,14.28 8.1,30.67 v1(14.2,36.76)
$2N1057: length 35.4
  Top Layer w0.406: v1(16.86,34.73) 16.86,36.2 U6.3 ; v1(32.07,12.14) U5.6
  Bottom Layer w0.406: v1(16.86,34.73) 17.37,34.22 23.22,34.22 32.07,25.37 v1(32.07,12.14)
$2N1062: length 24.7
  Top Layer w0.406: R10.1 32.87,35.49 31.55,36.81 U6.2
$2N1064: length 24.1
  Top Layer w0.406: R24.1 32.11,27.23 32.11,35.37 31.26,36.21 U6.4
$3N489: length 24.1
  Top Layer w0.406: U8.4 66.26,36.21 67.1,35.37 67.1,27.23 R26.1
$3N491: length 24.7
  Top Layer w0.406: R13.1 67.87,35.49 66.55,36.81 U8.2
$3N496: length 53
  Top Layer w0.406: U8.1 49.24,36.81 v1(49.2,36.76) ; v1(65.84,12.13) 65.84,10.53 U7.7
  Bottom Layer w0.254: v1(65.84,12.13) 65.45,12.51 44.88,12.51 43.1,14.28 43.1,30.67 v1(49.2,36.76)
$3N497: length 35.4
  Top Layer w0.406: v1(51.87,34.73) 51.87,36.2 U8.3 ; v1(67.07,12.14) U7.6
  Bottom Layer w0.406: v1(51.87,34.73) 52.37,34.22 58.22,34.22 67.07,25.37 v1(67.07,12.14)
$3N514: length 10.8
  Top Layer w0.254: U7.2 65.8,3.07 65.54,2.82 58.01,2.82 R30.1
$3N950: length 24.7
  Top Layer w0.406: R25.1 72.11,35.49 73.43,36.81 U10.4
$3N952: length 23.9
  Top Layer w0.406: U10.2 73.97,36.21 73,35.23 73,27.23 R16.1
$3N957: length 37.8
  Top Layer w0.406: 72.89,10.52 72.87,10.54 72.87,19.26 76.5,22.89 76.5,34.31 77.57,35.38 87.5,35.38 88.12,36.01 U10.1
$3N958: length 38.9
  Top Layer w0.406: 74.03,10.5 74.03,19.18 77.32,22.47 77.32,34.04 77.89,34.62 87.75,34.62 89,35.88 89,36.38 88.57,36.81 U10.3
$3N975: length 14.9
  Top Layer w0.254: v1(81.27,1.83) 81.27,3.86 R31.1 ; U9.2 72.87,3.14 v1(71.59,1.87)
  Bottom Layer w0.254: v1(71.59,1.87) 81.24,1.87 v1(81.27,1.83)

## Copper pours and planes (outline as drawn; the poured copper is in the pictures)
GND on Top Layer: 0,80 105,80 105,0 0,0
GND on Top Layer: 28.93,48.99 29.68,48.99 29.68,45.99 28.93,45.99
GND on Top Layer: 33.18,48.99 33.93,48.99 33.93,45.99 33.18,45.99
VCC on Bottom Layer: 0.51,80.51 105.51,80.51 105.51,0.51 0.51,0.51

## Text on the board
Bottom Silkscreen Layer: OptoGrid Charging Board V0.02 / Sainsbury Wellcom Centre / Fukui (Daniel) Yang, 2025/06/04
Top Silkscreen Layer: Green | Red | Extension | 5V/3A | 44.2kohm / 25mA/1C | Red = Charging / Green = Charging Done | Power | 1 | 4 | 2 | 5 | 3 | 6
